# Altium schematic sheet Activity_Recognition_Board_v1.0_Dispay_store.SchDoc
size A4
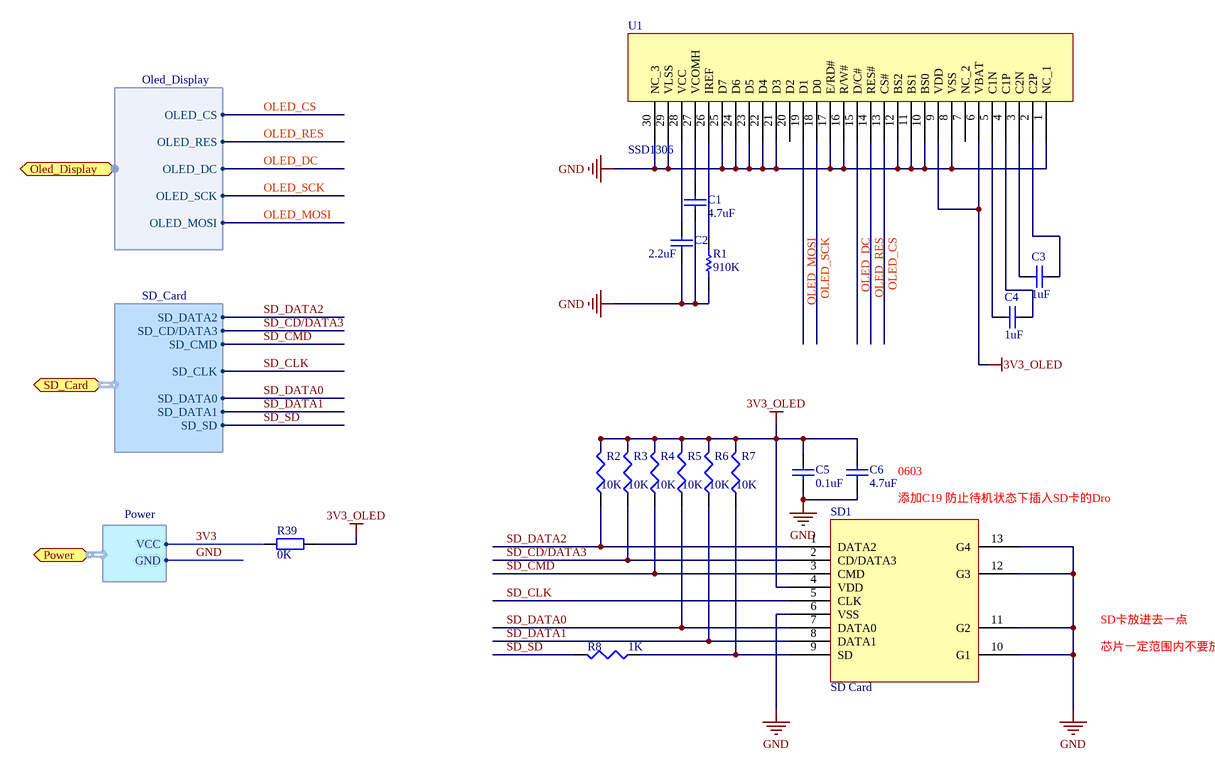
[diagram p0: Activity_Recognition_Board_v1.0_Dispay_store.SchDoc]

## Parts
C1  value 4.7uF  [C0603]  (hidden comment: Cap)
C2  value 2.2uF  [C0603]  (hidden comment: Cap)
C3  value 1uF  [C0402]  (hidden comment: Cap)
C4  value 1uF  [C0402]  (hidden comment: Cap)
C5  value 0.1uF  [C0402]  (hidden comment: Cap semi)
C6  value 4.7uF  [C0603]  (hidden comment: Cap semi)
R1  value 910K  [R0402]  (hidden comment: Res1)
R2  value 10K  [R0402]  (hidden comment: Res3)
R3  value 10K  [R0402]  (hidden comment: Res3)
R4  value 10K  [R0402]  (hidden comment: Res3)
R5  value 10K  [R0402]  (hidden comment: Res3)
R6  value 10K  [R0402]  (hidden comment: Res3)
R7  value 10K  [R0402]  (hidden comment: Res3)
R8  value 1K  [R0402]  (hidden comment: Res3)
R39  value 0K  [C0603]  (hidden comment: Res2)
SD1  SD Card  [SDCARD-M]
U1  SSD1306  [OLED_Bare]

## Ports
Oled_Display (harness Oled_Display), Power (harness Power), SD_Card (harness SD_Card)

## Harnesses
Power: VCC, GND
SD_Card: SD_DATA2, SD_CMD, SD_CD/DATA3, SD_CLK, SD_DATA0, SD_DATA1, SD_SD
Oled_Display: OLED_CS, OLED_RES, OLED_DC, OLED_SCK, OLED_MOSI

## Nets
3V3_OLED: C5.2 C6.2 R2.2 R3.2 R4.2 R5.2 R6.2 R7.2 R39.1 SD1.4(VDD) U1.6(VBAT) U1.9(VDD)
GND: C1.2 C2.2 C5.1 C6.1 R1.2 SD1.6(VSS) SD1.10(G1) SD1.11(G2) SD1.12(G3) SD1.13(G4) U1.1(NC_1) U1.8(VSS) U1.10(BS0) U1.11(BS1) U1.12(BS2) U1.16(R/W#) U1.17(E/RD#) U1.21(D3) U1.22(D4) U1.23(D5) U1.24(D6) U1.25(D7) U1.29(VLSS) U1.30(NC_3) ; port Power.GND
3V3: R39.2 ; port Power.VCC
OLED_CS: U1.13(CS#) ; port Oled_Display.OLED_CS
OLED_DC: U1.15(D/C#) ; port Oled_Display.OLED_DC
OLED_MOSI: U1.19(D1) ; port Oled_Display.OLED_MOSI
OLED_RES: U1.14(RES#) ; port Oled_Display.OLED_RES
OLED_SCK: U1.18(D0) ; port Oled_Display.OLED_SCK
SD_CD/DATA3: R3.1 SD1.2(CD/DATA3) ; port SD_Card.SD_CD/DATA3
SD_CLK: SD1.5(CLK) ; port SD_Card.SD_CLK
SD_CMD: R4.1 SD1.3(CMD) ; port SD_Card.SD_CMD
SD_DATA0: R5.1 SD1.7(DATA0) ; port SD_Card.SD_DATA0
SD_DATA1: R6.1 SD1.8(DATA1) ; port SD_Card.SD_DATA1
SD_DATA2: R2.1 SD1.1(DATA2) ; port SD_Card.SD_DATA2
SD_SD: R8.2 ; port SD_Card.SD_SD
NetC1_1: C1.1 U1.27(VCOMH)
NetC2_1: C2.1 U1.28(VCC)
NetC3_1: C3.1 U1.2(C2P)
NetC3_2: C3.2 U1.3(C2N)
NetC4_1: C4.1 U1.4(C1P)
NetC4_2: C4.2 U1.5(C1N)
NetR1_1: R1.1 U1.26(IREF)
NetR7_1: R7.1 R8.1 SD1.9(SD)

Not connected (* = marked no-connect by the designer): U1 7(NC_2) 20(D2)

## Notes on the sheet
- (near C6) 0603
- 添加C19 防止待机状态下插入SD卡的Dro
- Labels drawn without touching a wire or pin: SD卡放进去一点, 芯片一定范围内不要放电阻电容

## Library data of the parts
C1-C4 = Cap: Capacitor; Published: 8-Jun-2000; LatestRevisionDate: 17-Jul-2002; LatestRevisionNote: Re-released for DXP Platform.; PackageReference: RAD-0.3; Publisher: Altium Limited
C5 C6 = Cap semi: Capacitor (Semiconductor SIM Model); Published: 8-Jun-2000; LatestRevisionDate: 29-May-2009; LatestRevisionNote: IPC-7351 Footprint Added.; PackageReference: C1206; Publisher: Altium Limited; PackageDescription: Chip Capacitor
R1 = Res1: Resistor; Published: 8-Jun-2000; LatestRevisionDate: 17-Jul-2002; LatestRevisionNote: Re-released for DXP Platform.; PackageReference: AXIAL-0.3; Publisher: Altium Limited
R2-R8 = Res3: Resistor; Published: 8-Jun-2000; LatestRevisionDate: 29-May-2009; LatestRevisionNote: IPC-7351 Footprint Added.; PackageReference: J1-0603; Publisher: Altium Limited; PackageDescription: Chip Resistor
R39 = Res2: Resistor; Published: 8-Jun-2000; LatestRevisionDate: 17-Jul-2002; LatestRevisionNote: Re-released for DXP Platform.; PackageReference: AXIAL-0.4; Publisher: Altium Limited
SD1 = Micro_SD_Card: SD card socket